# Altium schematic sheet MotorDriver.SchDoc
size A4; SheetNumber: 3; SheetTotal: 3
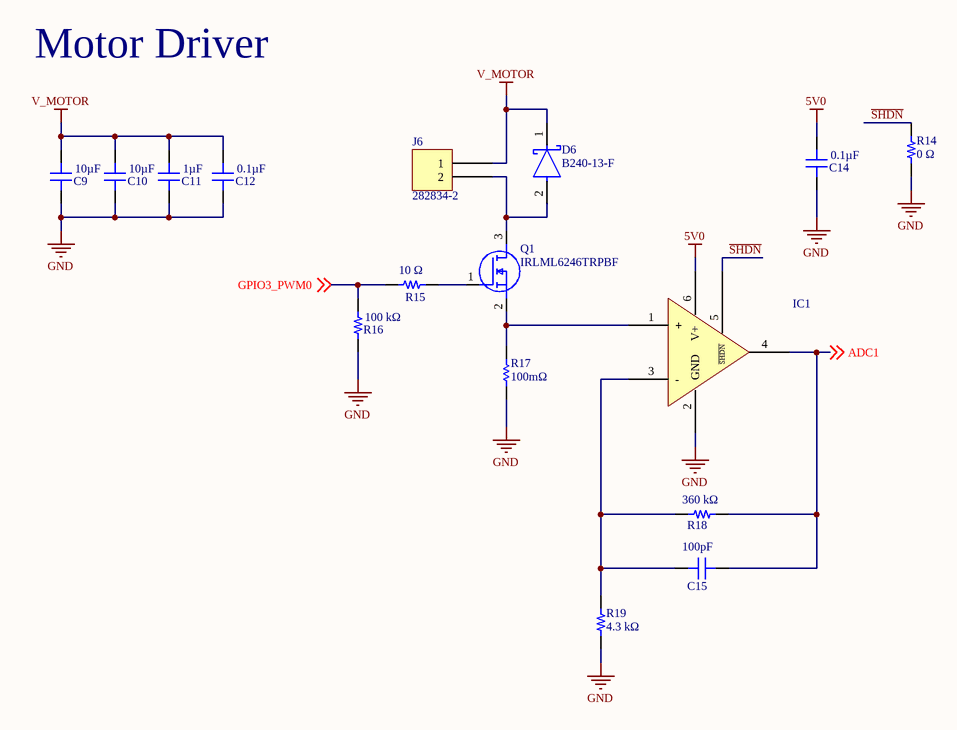
[diagram p0: MotorDriver.SchDoc]

## Parts
C9  10µF  [CAP 0805_2012]
C10  10µF  [CAP 0805_2012]
C11  1µF  [CAP 0805_2012]
C12  0.1µF  [CAP 0603_1608]
C14  0.1µF  [CAP 0603_1608]
C15  100pF  [CAP 0603_1608]
D6  B240-13-F  [FP-SMB-MFG]
IC1  LMV601MG/NOPB  [TI SC70-6 DCK]  (value not drawn)
J6  282834-2  [TE 282834-2]
Q1  IRLML6246TRPBF  [SOT95P237X112-3N]
R14  0 Ω  [RES 0603_1608]
R15  10 Ω  [RES 0603_1608]
R16  100 kΩ  [RES 0603_1608]
R17  100mΩ  [RESC3216X70X50LL05T20]
R18  360 kΩ  [RES 0603_1608]
R19  4.3 kΩ  [RES 0603_1608]

## Nets
5V0: C14.2 IC1.6(V+)
GND: C9.1 C10.1 C11.1 C12.1 C14.1 IC1.2(GND) R14.2 R16.1 R17.1 R19.2
V_MOTOR: C9.2 C10.2 C11.2 C12.2 D6.1(C) J6.1
ADC1: C15.2 IC1.4(OUT) R18.2 ; off-sheet ADC1
GPIO3_PWM0: R15.1 R16.2 ; off-sheet GPIO3_PWM0
~{SHDN}: IC1.5(~{SHDN}) R14.1
NetC15_1: C15.1 IC1.3(-) R18.1 R19.1
NetD6_2: D6.2(A) J6.2 Q1.3(D)
NetIC1_1: IC1.1(+) Q1.2(S) R17.2
NetQ1_1: Q1.1(G) R15.2

## Notes on the sheet
- Motor Driver

## Library data of the parts
C9 C10 = 08053D106KAT2A: CAP CER 10UF 25V X5R 0805; Manufacturer: AVX Corporation; Tolerance: ±10%; Part Number: 08053D106KAT2A; Applications: General Purpose; Capacitance: 10µF; ComponentLink1Description: Datasheet; ComponentLink1URL: http://datasheets.avx.com/cx5r.pdf; ComponentLink2Description: DigiKey Link; ComponentLink2URL: http://digikey.com/product-detail/en/avx-corporation/08053D106KAT2A/478-7436-1-ND/3660337; Device Package: 0805 (2012 Metric); LastUpdated: 2/3/2020 5:07:41 PM; Lifecycle Status: Active; Minimum Order: 1; Mounting Type: Surface Mount, MLCC; Operating Temperature: -55°C ~ 85°C; Package / Case: 0805 (2012 Metric); Packaging: TapeAndReel; Part Status: Active; Price: 0.13; Series: -; Size / Dimension: 0.079" L x 0.049" W (2.00mm x 1.25mm); Supplier 1: DigiKey; Supplier Part Number 1: 478-7436-1-ND; Temperature Coefficient: X5R; Thickness (Max): 0.051" (1.30mm); Value: 10µF; Voltage - Rated: 25V
C11 = 08053C105JAT2A: CAP CER 1UF 25V X7R 0805; Manufacturer: AVX Corporation; Tolerance: ±5%; Part Number: 08053C105JAT2A; Applications: General Purpose; Capacitance: 1µF; ComponentLink1Description: Datasheet; ComponentLink1URL: http://datasheets.avx.com/X7RDielectric.pdf; ComponentLink2Description: DigiKey Link; ComponentLink2URL: http://digikey.com/product-detail/en/avx-corporation/08053C105JAT2A/478-10487-1-ND/6797628; Device Package: 0805 (2012 Metric); LastUpdated: 2/3/2020 5:07:31 PM; Lifecycle Status: Active; Minimum Order: 1; Mounting Type: Surface Mount, MLCC; Operating Temperature: -55°C ~ 125°C; Package / Case: 0805 (2012 Metric); Packaging: TapeAndReel; Part Status: Active; Price: 0.09; Series: -; Size / Dimension: 0.079" L x 0.049" W (2.01mm x 1.25mm); Supplier 1: DigiKey; Supplier Part Number 1: 478-10487-1-ND; Temperature Coefficient: X7R; Thickness (Max): 0.037" (0.94mm); Value: 1µF; Voltage - Rated: 25V
C12 C14 = 06033C104JAT2A: CAP CER 0.1UF 25V X7R 0603; Manufacturer: AVX Corporation; Tolerance: ±5%; Part Number: 06033C104JAT2A; Applications: General Purpose; Capacitance: 0.1µF; ComponentLink1Description: Datasheet; ComponentLink1URL: http://datasheets.avx.com/X7RDielectric.pdf; ComponentLink2Description: DigiKey Link; ComponentLink2URL: http://digikey.com/product-detail/en/avx-corporation/06033C104JAT2A/478-3713-1-ND/1116411; Device Package: 0603 (1608 Metric); LastUpdated: 2/3/2020 5:05:47 PM; Lifecycle Status: Active; Minimum Order: 1; Mounting Type: Surface Mount, MLCC; Operating Temperature: -55°C ~ 125°C; Package / Case: 0603 (1608 Metric); Packaging: TapeAndReel; Part Status: Active; Price: 0.07; Series: -; Size / Dimension: 0.063" L x 0.032" W (1.60mm x 0.81mm); Supplier 1: DigiKey; Supplier Part Number 1: 478-3713-1-ND; Temperature Coefficient: X7R; Thickness (Max): 0.035" (0.90mm); Value: 0.1µF; Voltage - Rated: 25V
C15 = 06033A101KAT2A: CAP CER 100PF 25V C0G/NP0 0603; Manufacturer: AVX Corporation; Temperature Coefficient: C0G, NP0; Tolerance: ±10%; Part Number: 06033A101KAT2A; Applications: General Purpose; Capacitance: 100pF; ComponentLink1Description: Datasheet; ComponentLink1URL: http://datasheets.avx.com/C0GNP0-Dielectric.pdf; ComponentLink2Description: DigiKey Link; ComponentLink2URL: http://digikey.com/product-detail/en/avx-corporation/06033A101KAT2A/478-7895-1-ND/3881518; Device Package: 0603 (1608 Metric); LastUpdated: 2/3/2020 5:05:19 PM; Lifecycle Status: Active; Minimum Order: 1; Mounting Type: Surface Mount, MLCC; Operating Temperature: -55°C ~ 125°C; Package / Case: 0603 (1608 Metric); Packaging: TapeAndReel; Part Status: Active; Price: 0.04; Series: -; Size / Dimension: 0.063" L x 0.032" W (1.60mm x 0.81mm); Supplier 1: DigiKey; Supplier Part Number 1: 478-7895-1-ND; Thickness (Max): 0.035" (0.90mm); Value: 100pF; Voltage - Rated: 25V
D6 = CMP-12790-000044-1: DIODE SCHOTTKY 40V 2A SMB; Manufacturer: Diodes Inc.; Capacitance: 200pF; Peak Reverse Current: 0.5mA; Max Junction Temp: +150°C; Value: 200pF; Max Surge Forward Current: 50A; Standoff Height: 0.05mm; Forward Current: 2A; Device Class L2: Diodes; Device Class L1: Discrete Semiconductors; Reverse Voltage: 40V; Automotive: No; Lead Free: Yes; Octopart: https://octopart.com/b240-13-f-diodes+inc.-325780; Device Class L3: Schottky Diodes; Temperature Range Low: -65°C; RoHS: TRUE; Category: Diode; Max Repetitive Reverse Voltage: 40V; Temperature: -65°C to +150°C; ComponentLink2URL: https://www.diodes.com/assets/Datasheets/ds13004.pdf; Manufacturer Part Number: B240-13-F; Mouser Description: Schottky Diodes & Rectifiers 40V 2A; Temperature Range High: +150°C; Package: SMB; ComponentLink2Description: Datasheet; Footprint Url: https://www.diodes.com/assets/Package-Files/SMB.pdf; Height: 2.5mm; Digikey Description: DIODE SCHOTTKY 40V 2A SMB
IC1 = LMV601MG/NOPB: IC OPAMP GP 1 CIRCUIT SC70-6; Manufacturer: Texas Instruments; Amplifier Type: General Purpose; Current - Input Bias: 0.02pA; Current - Output / Channel: 113mA; Current - Supply: 107µA; Gain Bandwidth Product: 1MHz; Number of Circuits: 1; Output Type: Rail-to-Rail; Slew Rate: 1V/µs; Voltage - Input Offset: 250µV; Voltage - Supply, Single/Dual (±): 2.7V ~ 5.5V; Part Number: LMV601MG/NOPB; ComponentLink1Description: Datasheet; ComponentLink1URL: http://www.ti.com/general/docs/suppproductinfo.tsp?distId=10&gotoUrl=http%3A%2F%2Fwww.ti.com%2Flit%2Fgpn%2Flmv601; ComponentLink2Description: DigiKey Link; ComponentLink2URL: http://digikey.com/product-detail/en/texas-instruments/LMV601MG-NOPB/296-39050-1-ND/5143087; Device Package: 6-TSSOP, SC-88, SOT-363; LastUpdated: 2/3/2020 5:02:27 PM; Lifecycle Status: Active; Minimum Order: 1; Mounting Type: Surface Mount; Operating Temperature: -40°C ~ 125°C; Package / Case: 6-TSSOP, SC-88, SOT-363; Packaging: ReReel; Part Status: Active; Price: 0.00; Series: -; Supplier 1: DigiKey; Supplier Part Number 1: 296-39050-1-ND; Supplier Device Package: SC-70-6
J6 = 282834-2: TERM BLK 2P SIDE ENT 2.54MM PCB; Manufacturer: TE Connectivity AMP Connectors; Current: 10A; Mating Orientation: Horizontal with Board; Number of Levels: 1; Pitch: 0.100" (2.54mm); Positions Per Level: 2; Voltage: 150V; Wire Gauge: 16-30 AWG; Wire Termination: Screw - Rising Cage Clamp; Part Number: 282834-2; Color: Green; ComponentLink1Description: Datasheet; ComponentLink1URL: https://www.te.com/commerce/DocumentDelivery/DDEController?Action=srchrtrv&DocNm=282834&DocType=Customer+Drawing&DocLang=English; ComponentLink2Description: DigiKey Link; ComponentLink2URL: http://digikey.com/product-detail/en/te-connectivity-amp-connectors/282834-2/A98333-ND/1150135; LastUpdated: 2/3/2020 5:11:45 PM; Lifecycle Status: Active; Minimum Order: 1; Mounting Type: Through Hole; Packaging: Bulk; Part Status: Active; Price: 0.88; Series: Buchanan; Supplier 1: DigiKey; Supplier Part Number 1: A98333-ND
Q1 = IRLML6246TRPBF: MOSFET (N-Channel); Manufacturer_Name: Infineon; Datasheet Link: https://www.mouser.com/datasheet/2/196/irlml6246pbf-1228486.pdf; Height: 1.12mm; Manufacturer_Part_Number: IRLML6246TRPBF; Mouser Part Number: 942-IRLML6246TRPBF; Mouser Price/Stock: https://www.mouser.co.uk/ProductDetail/Infineon-IR/IRLML6246TRPBF?qs=9%252BKlkBgLFf2CL0BDviDAhg%3D%3D; Arrow Part Number: IRLML6246TRPBF; Arrow Price/Stock: https://www.arrow.com/en/products/irlml6246trpbf/infineon-technologies-ag?region=nac
R14 = AC0603FR-070RL: RES SMD 0 OHM JUMPER 1/10W 0603; Manufacturer: Yageo; Power (Watts): 0.1W, 1/10W; Value: 0 Ohms; Part Number: AC0603FR-070RL; ComponentLink1Description: Datasheet; ComponentLink1URL: https://www.yageo.com/upload/media/product/productsearch/datasheet/rchip/PYu-AC_51_RoHS_L_7.pdf; ComponentLink2Description: DigiKey Link; ComponentLink2URL: http://digikey.com/product-detail/en/yageo/AC0603FR-070RL/311-0.0LDCT-ND/2828133; Composition: Thick Film; Device Package: 0603 (1608 Metric); Features: Automotive AEC-Q200, Moisture Resistant; Height - Seated (Max): 0.022" (0.55mm); LastUpdated: 2/19/2020 6:28:06 AM; Lifecycle Status: Active; Minimum Order: 1; Number of Terminations: 2; Operating Temperature: -55°C ~ 155°C; Package / Case: 0603 (1608 Metric); Packaging: CutTape; Part Status: Active; Price: 0.10; Ratings: AEC-Q200; Resistance: 0 Ω; Series: AC; Size / Dimension: 0.063" L x 0.031" W (1.60mm x 0.80mm); Supplier 1: DigiKey; Supplier Part Number 1: 311-0.0LDCT-ND; Supplier Device Package: 0603; Tolerance: Jumper
R15 = AC0603FR-0710RL: RES SMD 10 OHM 1% 1/10W 0603; Manufacturer: Yageo; Power (Watts): 0.1W, 1/10W; Temperature Coefficient: ±200ppm/°C; Value: 10 Ohms; Part Number: AC0603FR-0710RL; ComponentLink1Description: Datasheet; ComponentLink1URL: https://www.yageo.com/upload/media/product/productsearch/datasheet/rchip/PYu-AC_51_RoHS_L_7.pdf; ComponentLink2Description: DigiKey Link; ComponentLink2URL: http://digikey.com/product-detail/en/yageo/AC0603FR-0710RL/311-10LDCT-ND/2828514; Composition: Thick Film; Device Package: 0603 (1608 Metric); Features: Automotive AEC-Q200, Moisture Resistant; Height - Seated (Max): 0.022" (0.55mm); LastUpdated: 2/19/2020 6:28:06 AM; Lifecycle Status: Active; Minimum Order: 1; Number of Terminations: 2; Operating Temperature: -55°C ~ 155°C; Package / Case: 0603 (1608 Metric); Packaging: TapeAndReel; Part Status: Active; Price: 0.01; Ratings: AEC-Q200; Resistance: 10 Ω; Series: AC; Size / Dimension: 0.063" L x 0.031" W (1.60mm x 0.80mm); Supplier 1: DigiKey; Supplier Part Number 1: 311-10LDCT-ND; Supplier Device Package: 0603; Tolerance: ±1%
R16 = AC0603FR-07100KL: RES SMD 100K OHM 1% 1/10W 0603; Manufacturer: Yageo; Power (Watts): 0.1W, 1/10W; Temperature Coefficient: ±100ppm/°C; Value: 100 kOhms; Part Number: AC0603FR-07100KL; ComponentLink1Description: Datasheet; ComponentLink1URL: https://www.yageo.com/upload/media/product/productsearch/datasheet/rchip/PYu-AC_51_RoHS_L_7.pdf; ComponentLink2Description: DigiKey Link; ComponentLink2URL: http://digikey.com/product-detail/en/yageo/AC0603FR-07100KL/311-100KLDCT-ND/2828134; Composition: Thick Film; Device Package: 0603 (1608 Metric); Features: Automotive AEC-Q200, Moisture Resistant; Height - Seated (Max): 0.022" (0.55mm); LastUpdated: 2/19/2020 6:28:06 AM; Lifecycle Status: Active; Minimum Order: 1; Number of Terminations: 2; Operating Temperature: -55°C ~ 155°C; Package / Case: 0603 (1608 Metric); Packaging: CutTape; Part Status: Active; Price: 0.10; Ratings: AEC-Q200; Resistance: 100 kΩ; Series: AC; Size / Dimension: 0.063" L x 0.031" W (1.60mm x 0.80mm); Supplier 1: DigiKey; Supplier Part Number 1: 311-100KLDCT-ND; Supplier Device Package: 0603; Tolerance: ±1%
R17 = CMP-2003-00708-1: ERJ-L08KF10CV; Manufacturer: Panasonic; Part Number: ERJ-L08KF10CV
R18 = CR0603-FX-3603ELF: RES SMD 360K OHM 1% 1/10W 0603; Manufacturer: Bourns Inc.; Power (Watts): 0.1W, 1/10W; Temperature Coefficient: ±100ppm/°C; Value: 360 kOhms; Part Number: CR0603-FX-3603ELF; ComponentLink1Description: Datasheet; ComponentLink1URL: https://www.bourns.com/docs/Product-Datasheets/CHPREZTR.pdf; ComponentLink2Description: DigiKey Link; ComponentLink2URL: http://digikey.com/product-detail/en/bourns-inc/CR0603-FX-3603ELF/CR0603-FX-3603ELFCT-ND/8602033; Composition: Thick Film; Device Package: 0603 (1608 Metric); Features: Moisture Resistant; Height - Seated (Max): 0.022" (0.55mm); LastUpdated: 2/19/2020 6:28:06 AM; Lifecycle Status: Active; Minimum Order: 1; Number of Terminations: 2; Operating Temperature: -55°C ~ 155°C; Package / Case: 0603 (1608 Metric); Packaging: TapeAndReel; Part Status: Active; Price: 0.01; Resistance: 360 kΩ; Series: CR0603; Size / Dimension: 0.063" L x 0.031" W (1.60mm x 0.80mm); Supplier 1: DigiKey; Supplier Part Number 1: CR0603-FX-3603ELFCT-ND; Supplier Device Package: 0603; Tolerance: ±1%
R19 = CPF0603B4K3E1: RES SMD 4.3K OHM 0.1% 1/16W 0603; Manufacturer: TE Connectivity Passive Product; Power (Watts): 0.063W, 1/16W; Temperature Coefficient: ±25ppm/°C; Value: 4.3 kOhms; Part Number: CPF0603B4K3E1; ComponentLink1Description: Datasheet; ComponentLink1URL: https://www.te.com/commerce/DocumentDelivery/DDEController?Action=srchrtrv&DocNm=1773200&DocType=DS&DocLang=English; ComponentLink2Description: DigiKey Link; ComponentLink2URL: http://digikey.com/product-detail/en/te-connectivity-passive-product/CPF0603B4K3E1/A103104CT-ND/2728657; Composition: Thin Film; Device Package: 0603 (1608 Metric); Height - Seated (Max): 0.022" (0.55mm); LastUpdated: 2/19/2020 6:28:06 AM; Lifecycle Status: Active; Minimum Order: 1; Number of Terminations: 2; Operating Temperature: -55°C ~ 155°C; Package / Case: 0603 (1608 Metric); Packaging: TapeAndReel; Part Status: Active; Price: 0.12; Resistance: 4.3 kΩ; Series: CPF, Neohm; Size / Dimension: 0.061" L x 0.031" W (1.55mm x 0.80mm); Supplier 1: DigiKey; Supplier Part Number 1: A103104CT-ND; Supplier Device Package: 0603; Tolerance: ±0.1%